# Altium project Cap.PrjPcb
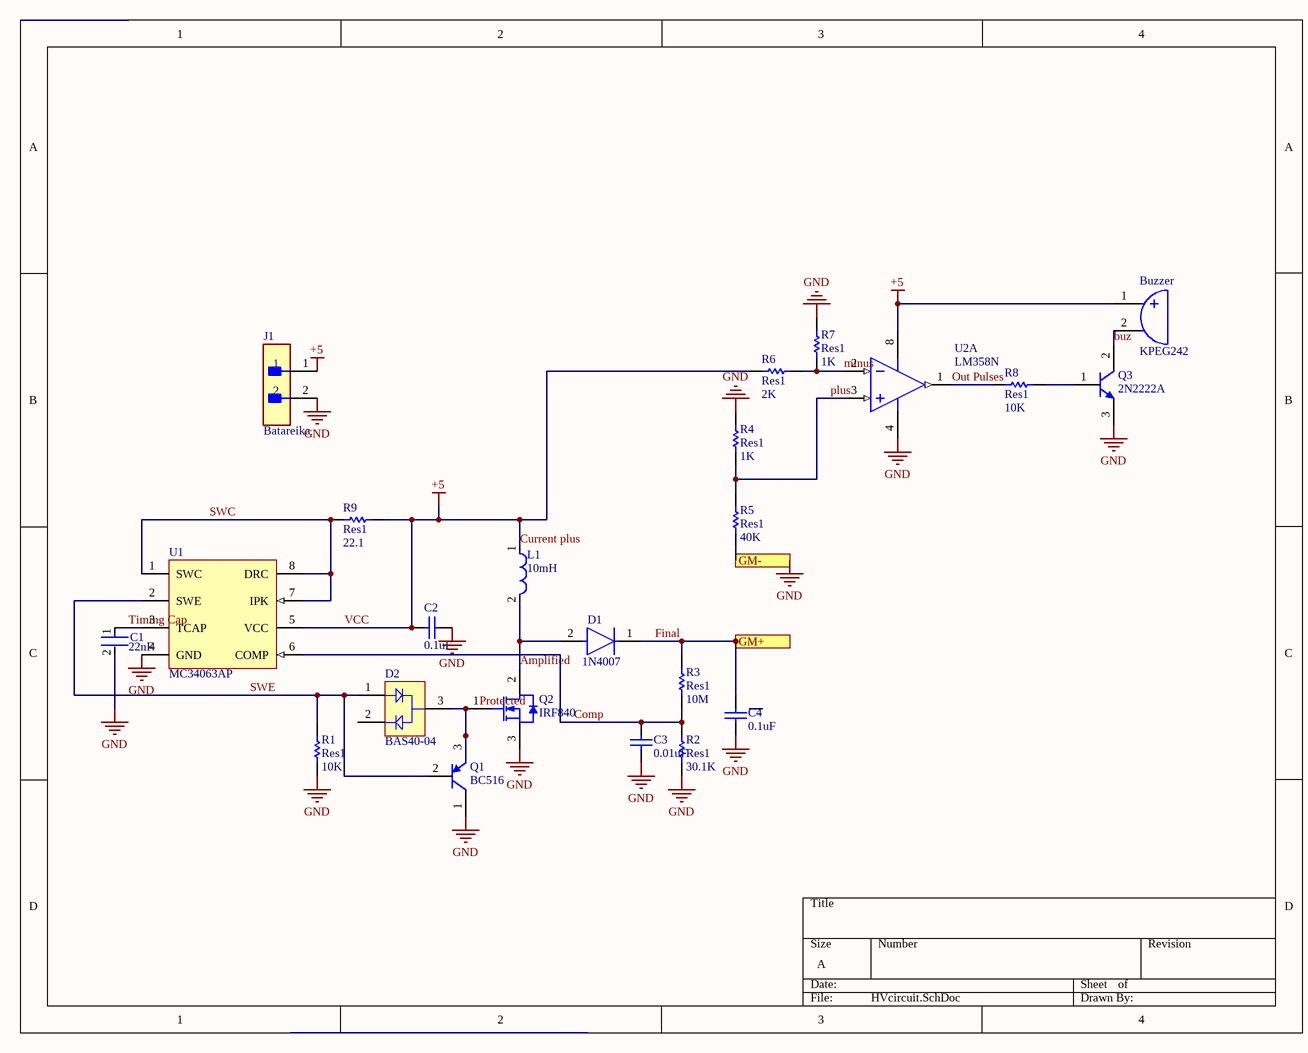
[diagram p0: HVcircuit.SchDoc]
1 sheet, 23 parts. Net scope: flat (ports and power ports of the same name join across sheets).
Board files: HVpcb.PcbDoc, tengo.PcbDoc

## Sheet HVcircuit.SchDoc
size A; SheetNumber: 1; SheetTotal: 1

### Parts
Buzzer  KPEG242  [KINGS-KPEG242-2]
C1  22nF  [FP-RCE1K1-2_5-MFG]
C2  0.1uF  [CAPR51-254-508X318X736]
C3  0.01uF  [KEMT-C315-THT-2]
C4  0.1uF  [CAPR51-254-508X318X736]
D1  1N4007  [FP-1N4007-MFG]
D2  BAS40-04  [INF-SOT23_L]
J1  Batareika  [FP-350428-1-MFG]
L1  10mH  [FP-LQH55DN_03-MFG]
Q1  BC516  [ONSC-TO-92-3-29-11]
Q2  IRF840  [VISH-TO-220AB-3]
Q3  2N2222A  [STM-TO-18-3]
R1  Res1  value 10K  [AXIAL-0.3]
R2  Res1  value 30.1K  [AXIAL-0.3]
R3  Res1  value 10M  [AXIAL-0.3]
R4  Res1  value 1K  [AXIAL-0.3]
R5  Res1  value 40K  [AXIAL-0.3]
R6  Res1  value 2K  [AXIAL-0.3]
R7  Res1  value 1K  [AXIAL-0.3]
R8  Res1  value 10K  [AXIAL-0.3]
R9  Res1  value 22.1  [AXIAL-0.3]
U1  MC34063AP  [P0008A]
U2  LM358N  [ONSC-PDIP-8-626-05_M]  (part A of 2)

### Ports
GM+, GM-

### Nets
Current plus: Buzzer.1 C2.1 J1.1 L1.1 R6.1 R9.1 U1.5(VCC) U2.8(VCC)  [also labelled +5, VCC]
GND: C1.2 C2.2 C3.2 C4.1 J1.2 Q1.1(C) Q2.3(S) Q3.3(E) R1.1 R2.1 R4.1 R5.1 R7.2 U1.4(GND) U2.4(VEE/GND) ; port GM-
Amplified: D1.2(A) L1.2 Q2.2(D)
buz: Buzzer.2 Q3.2(C)
Comp: C3.1 R2.2 R3.1 U1.6(COMP)
Final: C4.2 D1.1(C) R3.2 ; port GM+
minus: R6.2 R7.1 U2.2(INA-)
Out Pulses: R8.1 U2.1(OUTA)
plus: R4.2 R5.2 U2.3(INA+)
SWC: R9.2 U1.1(SWC) U1.7(IPK) U1.8(DRC)
SWE: D2.1(A1) Q1.2(B) R1.2 U1.2(SWE)
Timing Cap: C1.1 U1.3(TCAP)
NetD2_3: D2.3(C) Q1.3(E) Q2.1(G)
NetQ3_1: Q3.1(B) R8.2

Not connected (* = marked no-connect by the designer): D2 2(K2)

### Notes on the sheet
- Labels drawn without touching a wire or pin: Protected

### Library data of the parts
Buzzer = CMP-2000-06518-1: Piezo Indicator, 4100 Hz, 3 to 16 V, -20 to 70 degC, 2-Pin THD, RoHS; PartNumber: KPE-242; Manufacturer: KingstateElectronicsCorp.; Frequency Range: 3600to4600Hz; Maximum Supply Current: 7mA; Typical Operating Supply Voltage: 12Vdc; Product Height: 7.6mm; Current - Max: 7A; Tone Mode: Continuous; Product Diameter: 13.7mm; Minimum Sound Pressure: 70dBA; Maximum Resonant Frequency: 4600Hz; Type: Indicator; Datasheet URL: https://datasheet.ciiva.com/11776/0900766b8068f3a2-11776713.pdf; Mounting: ThroughHole; Technology: Piezo; Operating Temperature: -20to70°C; Category: AudioIndicatorsandAlerts; Termination Method: Pin; Manufacturer URL: http://www.kingstate.com.tw/index.php/en/; Package Description: 2-Pin Through Hole Device, Body Dia 13.7 mm, Pitch 7.62 mm; Datasheet Version: 01/2006; Package Reference: KPEG242; Mounting Technology: ThroughHole
C1 = CMP-06035-035148-1: Cap Ceramic Monolithic 22nF 50V 5% Thru-Hole Bulk; Lead Diameter: 0.5mm; Lead/Base Style: Formed Leads; Dielectric: C0G; Case/Package: Radial; Min Operating Temperature: -55°C; Termination: Radial; Width: 0.098inch; Height: 3.5mm; Lead Pitch: 0.197inch; Height - Seated (Max): 0.138inch; Voltage Rating: 50V; Voltage Rating (DC): 50V; Package Quantity: 500; Capacitance: 22nF; Ratings: AEC-Q200; Resistor Type: Ceramic; Mount: Through Hole; Packaging: Bulk; Length: 0.157inch; Tolerance: 5%; Max Operating Temperature: 125°C
C2 C4 = CMP-1664-00004-1: Radial Leaded Multilayer Ceramic Capacitor, 0.1 uF, +/- 10%, 50 V, -55 to 125 degC, 2-Pin THD, RoHS, Tape and Reel; Case\Package: SOT-23-5; Max Power Dissipation: 250 mW; Output Current: 150 mA; Dropout Voltage: 260 mV; Outputs: 1; Output Voltage: 5 V; Max Input Voltage: 8 V; Min Operating Temperature: -40 degC; Packaging: Tape and Reel; Height: 1.3 mm; Radiation Hardening: No; Pins: 5; ComponentLink1Description: Manufacturer URL; Mount: Surface Mount; RoHSCompliant: true; Max Operating Temperature: 85 degC; PackageReference: CAPR51-254-508X318X736; ComponentLink2URL: http://www.kemet.com/docfinder?Partnumber=C320C104K5R5TA; PackageDescription: 2-Pin Through Hole Device, Body 5.08 x 3.18 mm, Pitch 2.54 mm; ComponentLink1URL: http://www.kemet.com/; Width: 1.8 mm; Package Quantity: 3000; DatasheetVersion: Dec-15; Length: 3 mm; ComponentLink2Description: Datasheet
C3 = CMP-1664-00007-1: Capacitor, Ceramic, 0.01 uF, +/- 10%, 100 V, X7R, -55 to 125 degC, 2-Pin THD, RoHS, Bulk; Output Voltage: 70 V; Case\Package: PDIP; Forward Current: 60 mA; Nominal Vf: 1.3 V; Forward Voltage: 1.5 V; Channels: 2; Max Power Dissipation: 400 mW; Vce Max: 500 mV; ComponentLink1Description: Manufacturer URL; ComponentLink2Description: Datasheet; Packaging: Rail/Tube; RoHSCompliant: true; Package Quantity: 2000; PackageReference: C315-THT-2; Min Operating Temperature: -55 degC; Max Operating Temperature: 100 degC; Radiation Hardening: No; ComponentLink1URL: http://www.kemet.com/; DatasheetVersion: Aug-16; Pins: 16; PackageDescription: 2-Pin Through Hole Device, Body 3.81 x 2.54 mm; REACH SVHC: Unknown; Mount: Through Hole; ComponentLink2URL: http://capacitoredge.kemet.com/capedge2/DataSheet/Datasheet-C315C103K1R5TA.pdf?pn=C315C103K1R5TA{BULK}
D1 = CMP-123542-000001-1: Rectifier diode 1000 V 1 A DO-41, ,; Manufacturer: Diotec; Max Surge Forward Current: 27A; Forward Current: 1A; Max Junction Temp: +175°C; Reverse Voltage: 1000V; Value: 15pF; Peak Reverse Current: 5uA; Category: Diode; Temperature Range Low: -50°C; Automotive: No; Temperature: -50°C to +175°C; Lead Free: Yes; ComponentLink2Description: Datasheet; Max Repetitive Reverse Voltage: 1000V; ComponentLink2URL: https://datasheet.octopart.com/1N4007-Diotec-datasheet-62346875.pdf; Manufacturer Part Number: 1N4007; Device Class L3: Rectifier Diodes; Height: 2.8mm; Octopart: https://octopart.com/1n4007-diotec-4040411; Package: 1N4007; Temperature Range High: +175°C; Device Class L1: Discrete Semiconductors; Device Class L2: Diodes; RoHS: TRUE; Capacitance: 15pF; Ipc Land Pattern Name: DIOAD888W100L520D280
D2 = CMP-1182-00024-1: Silicon Schottky Diode, -55 to 150 degC, SOT23, Reel, Green; Manufacturer: Infineon; CT (max): 5Â pF; VF (max): 1,000Â mV; VR (max): 40Â V; Green: TRUE; Configuration: Dual; IF (max): 120Â mA; ComponentLink3Description: Package Specification; Mounting Technology: Surface Mount; ComponentLink2Description: Datasheet; PackageVersion: Apr-08; Packing: Reel; PackageReference: SOT23; PackageDescription: 3-Pin Small Outline Transistor Package, 1.3 x 2.9 mm Body, 0.95 mm Pitch; ComponentLink3URL: http://www.infineon.com/dgdl/SOT23-Package_Overview.pdf?folderId=db3a30431936bc4b0119532290053c66&fileId=db3a30431936bc4b0119533468123c85; ComponentLink2URL: http://www.infineon.com/dgdl/bas40_bas140series.pdf?folderId=db3a30431400ef68011425f1ca2505e3&fileId=db3a304314dca389011518a57ed20e11; PartNumber: BAS40-04; ComponentLink1Description: Manufacturer URL; ComponentLink1URL: http://www.infineon.com/
J1 = CMP-03369-000080-1: CONN HEADER VERT 2POS 6.35MM; Manufacturer: TE Connectivity; Manufacturer Part Number: 350428-1; Standoff Height: 0.63mm; Number Of Contacts: 2; Conn Gender: Male; Voltage Rating: 600V; Conn Orientation: Vertical; Current Rating: 12A; Number Of Rows: 1; Mouser Description: Connector, Soft Shell; Universal MATE-N-LOK; 2; Nylon; Natural; 19 A; 600 VAC; Height: 14.99mm; Pitch: 6.35mm; ComponentLink2URL: https://www.te.com/commerce/DocumentDelivery/DDEController?Action=showdoc&DocId=Customer+Drawing%7F350428%7FY2%7Fpdf%7FEnglish%7FENG_CD_350428_Y2.pdf%7F350428-1; Device Class L1: Connectors; Automotive: No; Octopart: https://octopart.com/350428-1-te+connectivity-46505355; Digikey Description: CONN HEADER VERT 2POS 6.35MM; RoHS: TRUE; Temperature: -40°C to +105°C; Contact Material: Gold,Nickel; Package: 350428-1; Temperature Range Low: -40°C; Device Class L3: unset; Lead Free: Yes; Device Class L2: Headers and Wire Housings; Category: Conn; ComponentLink2Description: Datasheet; Temperature Range High: +105°C
L1 = CMP-06042-013153-1: Wire Wound Ferrite Inductor for Power Lines 10000μH ±20% 140Ω  0.05A 2220; DC Resistance (DCR): 100R; DC Current: 50mA; Test Frequency: 10kHz; Self Resonant Frequency: 500kHz; Shielding: Unshielded; Military Standard: Not; Case Code (Imperial): 2220; Min Operating Temperature: -25°C; Current Rating: 50mA; Inductance: 10mH; Core Material: Ferrite; Resistor Type: Wirewound; Case/Package: 2220; REACH SVHC: No SVHC; Inductance Tolerance: 20%; Depth: 5.3mm; Package Quantity: 350; Height - Seated (Max): 0.198inch; Packaging: Tape and Reel; Height: 4.7mm; Tolerance: 20%; Length: 5.7mm; Mount: Surface Mount; Max DC Current: 50mA; Radiation Hardening: No; Termination: SMD/SMT; Series Resistance: 100R; Case Code (Metric): 5750; Max Operating Temperature: 80°C; Weight: 0.016932oz; Width: 6mm
Q1 = CMP-1048-01441-1: Amplifier Transistor, PNP Silicon, 3-Pin TO-92, Pb-Free, Bulk Box; Manufacturer: On Semiconductor; PartNumber: BC557CG; IC Continuous (A): -0.1; RoHS: TRUE; DatasheetVersion: Rev. 3; ComponentLink2Description: Datasheet; Packing: Bulk Box; PackageReference: TO-92-3-29-11_AM_SL; ComponentLink3URL: http://www.onsemi.cn/pub_link/Collateral/2N6426-D.PDF; ComponentLink2URL: http://www.onsemi.com/pub_link/Collateral/BC556B-D.PDF; PackageDescription: 3-Pin Transistor Outline, Body 4.825 x 3.685 mm, Pitch 1.27 mm; PackageVersion: Rev. AM; ComponentLink3Description: Package Specification; ComponentLink1URL: http://www.onsemi.com/; ComponentLink1Description: Manufacturer URL; Polarity: PNP; Mounting Technology: Through Hole
Q2 = CMP-2000-06467-1: Power MOSFET, 500 V, -55 to 150 degC, 3-Pin FM, RoHS, Tape and Reel; Manufacturer: Vishay; Maximum Gate Source Voltage: ±20V; Channel Mode: Enhancement; Typical Gate Charge @ Vgs: 63nC@10V; Number of Elements per Chip: 1; Typical Turn-On Delay Time: 14ns; Typical Input Capacitance @ Vds: 1300pF@25V; Maximum Continuous Drain Current: 8A; Maximum Drain Source Voltage: 500V; Minimum Gate Threshold Voltage: 2V; Typical Turn-Off Delay Time: 49ns; Maximum Drain Source Resistance: 0.85Ω; Maximum Power Dissipation: 125W; Channel Type: N; Mounting Type: ThroughHole; Datasheet URL: https://datasheet.ciiva.com/26791/irf840pbf-26791500.pdf; Package Type: TO-220AB; Dimensions: 10.41x4.7x9.01mm; Category: PowerMOSFET; Width: 4.7mm; Datasheet Version: Rev. C, 03/2011; Maximum Operating Temperature: +150°C; Manufacturer URL: http://www.vishay.com/; Package Description: 3-Pin Flange Mount, Body 10.275 x 4.45 mm, Pitch 2.54 mm; Length: 10.41mm; Height: 9.01mm; Mounting Technology: ThroughHole; Package Reference: TO-220AB-3; Pin Count: 3; Minimum Operating Temperature: -55°C; Package URL: http://www.vishay.com/docs/71195/to220ab.pdf
Q3 = CMP-2000-05381-1: High Speed Switch, 0.6 A IC, -65 to 175 degC, 3-Pin TO-18, RoHS, Bulk; Manufacturer: STMicroelectronics; Power Dissipation Pd: 500mW; DC Current Gain hFE: 300hFE; Transistor Polarity: NPN; DC Collector Current: 600mA; No. of Pins: 3Pins; Transition Frequency ft: 300MHz; Collector Emitter Voltage V(br)ceo: 40V; Product Range: -; Package Reference: TO-18-3; Datasheet URL: https://datasheet.ciiva.com/25917/cd00003223-25917094.pdf; Automotive Qualification Standard: -; Transistor Case Style: TO-18; Operating Temperature Max: 175degC; Datasheet Version: Feb-03; Package Description: 3-Pin Through Hole Device, Dia 5.8 mm, Pitch 1.27 mm; Manufacturer URL: http://www.st.com/
R1-R9 = Res1: Resistor; Published: 8-Jun-2000; LatestRevisionDate: 17-Jul-2002; LatestRevisionNote: Re-released for DXP Platform.; PackageReference: AXIAL-0.3; Publisher: Altium Limited; PackageDescription: Axial Device, Thru-Hole; 2 Leads; 0.3 in Pin Spacing
U1 = CMP-0323-00037-3: Buck Inverting Buck-Boost Regulator with 3 to 40 V Input and 1.55 to 40 V Output, 0 to 70 degC, 8-Pin PDIP (P), Pb-Free (RoHS); Manufacturer: Texas Instruments; Iq(Typ)(mA): 4; SubFamily: Inverting Regulator; Vin(Min)(V): 3; Rating: Catalog; Topology: Buck, Inverting Buck-Boost; Vin(Max)(V): 40; Switch Current Limit(Typ)(A): 1.5; Vout(Min)(V): 1.55; Iout(Max)(A): 0.75; Regulated Outputs(#): 1; Duty Cycle(Max)(%): 90; Eco-Plan: Pb-Free (RoHS); ComponentLink3URL: Samples URL:http://www.ti.com/product/mc34063a#samples; ComponentLink1Description: Datasheet; DatasheetVersion: SLLS636M; ComponentLink2Description: Package Specification; PartNumber: MC34063AP; PackageReference: P0008A; ComponentLink3Description: URL Link1; PackageDescription: 8-Pin Plastic Dual-In-Line Package, Row Spacing 7.62 mm, Pitch 2.54 mm; Vout(Max)(V): 40; Code_JEDEC: MS-001-BA; ComponentLink2URL: http://www.ti.com/lit/ml/mpdi001b/mpdi001b.pdf; PackageVersion: revE, Apr-2010; ComponentLink1URL: http://www.ti.com/general/docs/lit/getliterature.tsp?genericPartNumber=MC34063A&fileType=pdf; Mounting Technology: Through Hole
U2 = CMP-1310-00098-1: Single Supply Dual Operational Amplifier, 3 to 32 V, 0 to 70 degC, 8-Pin PDIP, Tube; Manufacturer: On Semiconductor; VCC Max (V): 32; VCC Min (V): 3; Mounting Technology: Through Hole; ComponentLink3Description: Package Specification; ComponentLink3URL: http://www.onsemi.com/pub_link/Collateral/LM211-D.PDF; RoHS: FALSE; Packing: Tube; PackageDescription: 8-Pin Plastic Dual-In Line Package, Body 9.52 x 6.605 mm, Pitch 2.54 mm; PackageReference: PDIP-8-626-05; PackageVersion: Rev. M, 04/2010; PartNumber: LM358N; ComponentLink2Description: Datasheet; ComponentLink2URL: http://www.onsemi.cn/pub_link/Collateral/LM358-D.PDF; ComponentLink1URL: http://www.onsemi.com/; ComponentLink1Description: Manufacturer URL; DatasheetVersion: Rev. 27